# EAGLE design motor (EAGLE 7.2.0)
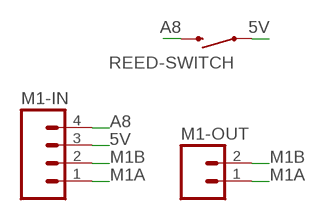
[diagram p0: schematic, sheet 1]

## Parts
M1-IN  M04JST  [1X04-1.5MM_JST]
M1-OUT  M02JST-PTH-2  [JST-2-PTH]
REED-SWITCH  SWITCH-MOMENTARY-2PTH_REED2  [REED_SWITCH_PLASTIC]

## Nets
5V: M1-IN.3 REED-SWITCH.P$1
A8: M1-IN.4 REED-SWITCH.P$2
M1A: M1-IN.1 M1-OUT.1
M1B: M1-IN.2 M1-OUT.2

## Library data of the parts
M1-IN = SparkFun-Connectors:M04: Header 4 Standard 4-pin 0.1" header. Use with straight break away headers (SKU : PRT-00116), right angle break away headers (PRT-00553), swiss pins (PRT-00743), machine pins (PRT-00117), and female headers (PRT-00115). Molex polarized connector foot print use with SKU : PRT-08231 with associated crimp pins and housings. 1MM SMD Version SKU: PRT-10208
M1-OUT = SparkFun-Connectors:M02: Standard 2-pin 0.1" header. Use with - straight break away headers ( PRT-00116) - right angle break away headers (PRT-00553) - swiss pins (PRT-00743) - machine pins (PRT-00117) - female headers (PRT-00115) Molex polarized connector foot print use with: PRT-08233 with associated crimp pins and housings. 2.54_SCREWTERM for use with PRT-10571. 3.5mm Screw Terminal footprints for PRT-08084 5mm Screw Terminal footprints for use with PRT-08432; PROD_ID: CONN-09863; SKU: PRT-09914
REED-SWITCH = SparkFun-Electromechanical:SWITCH-MOMENTARY-2: Various NO switches- pushbuttons, reed, etc

## Net classes
0 default: width 0.203 mm

## Board
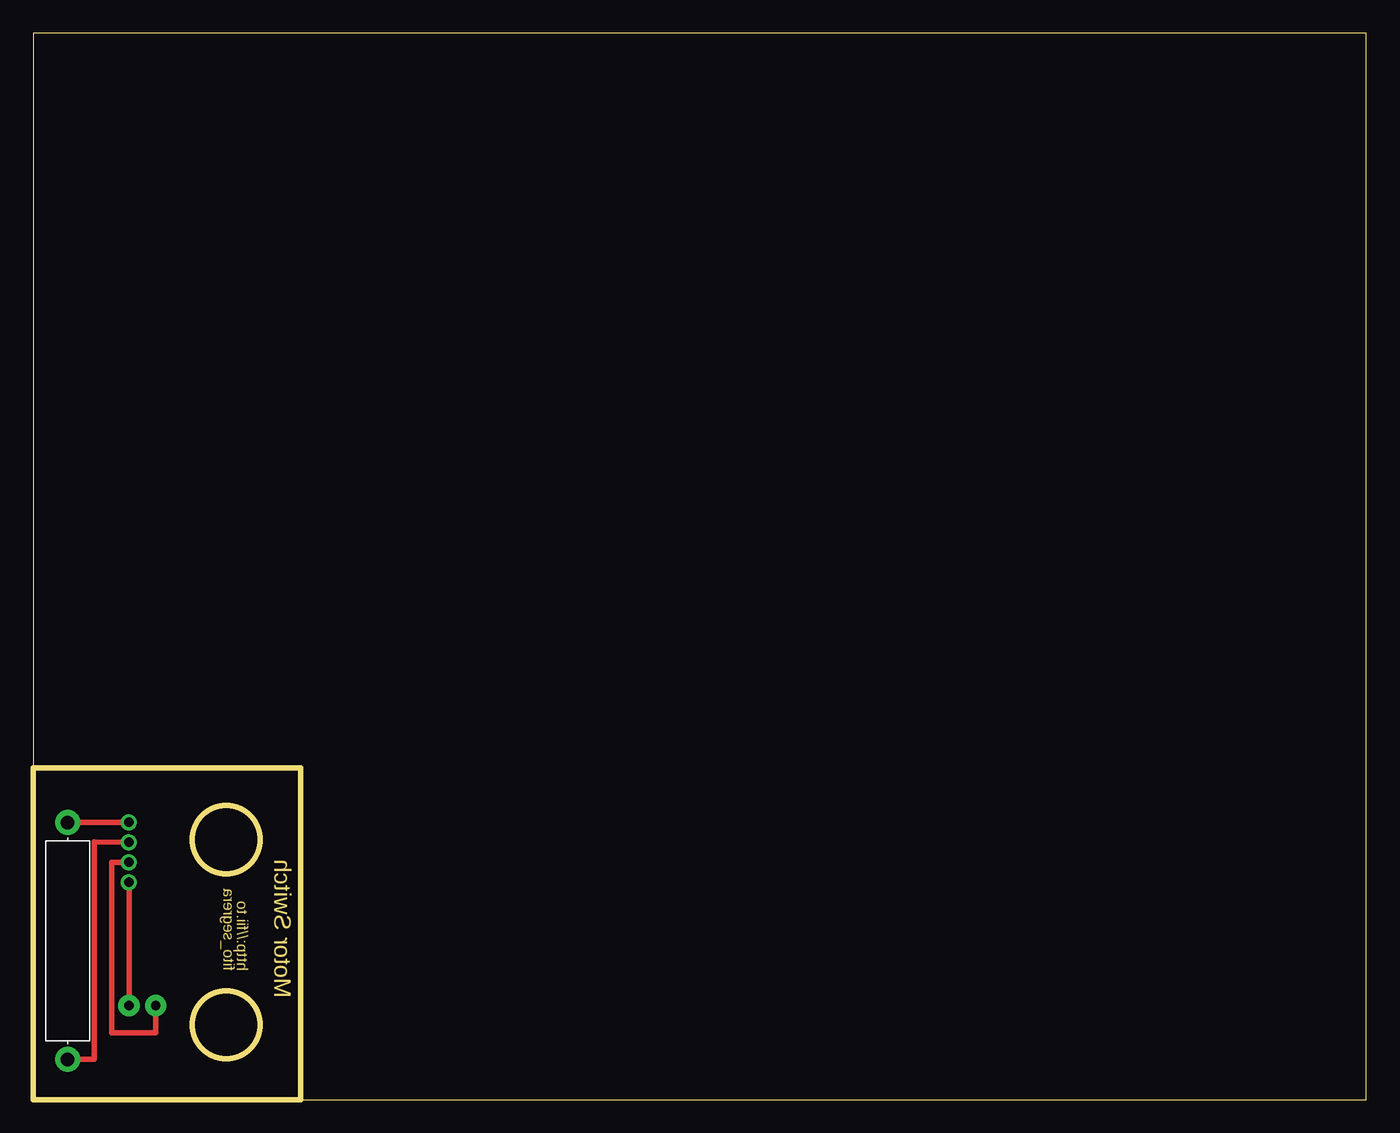
[diagram p1: board, top side]
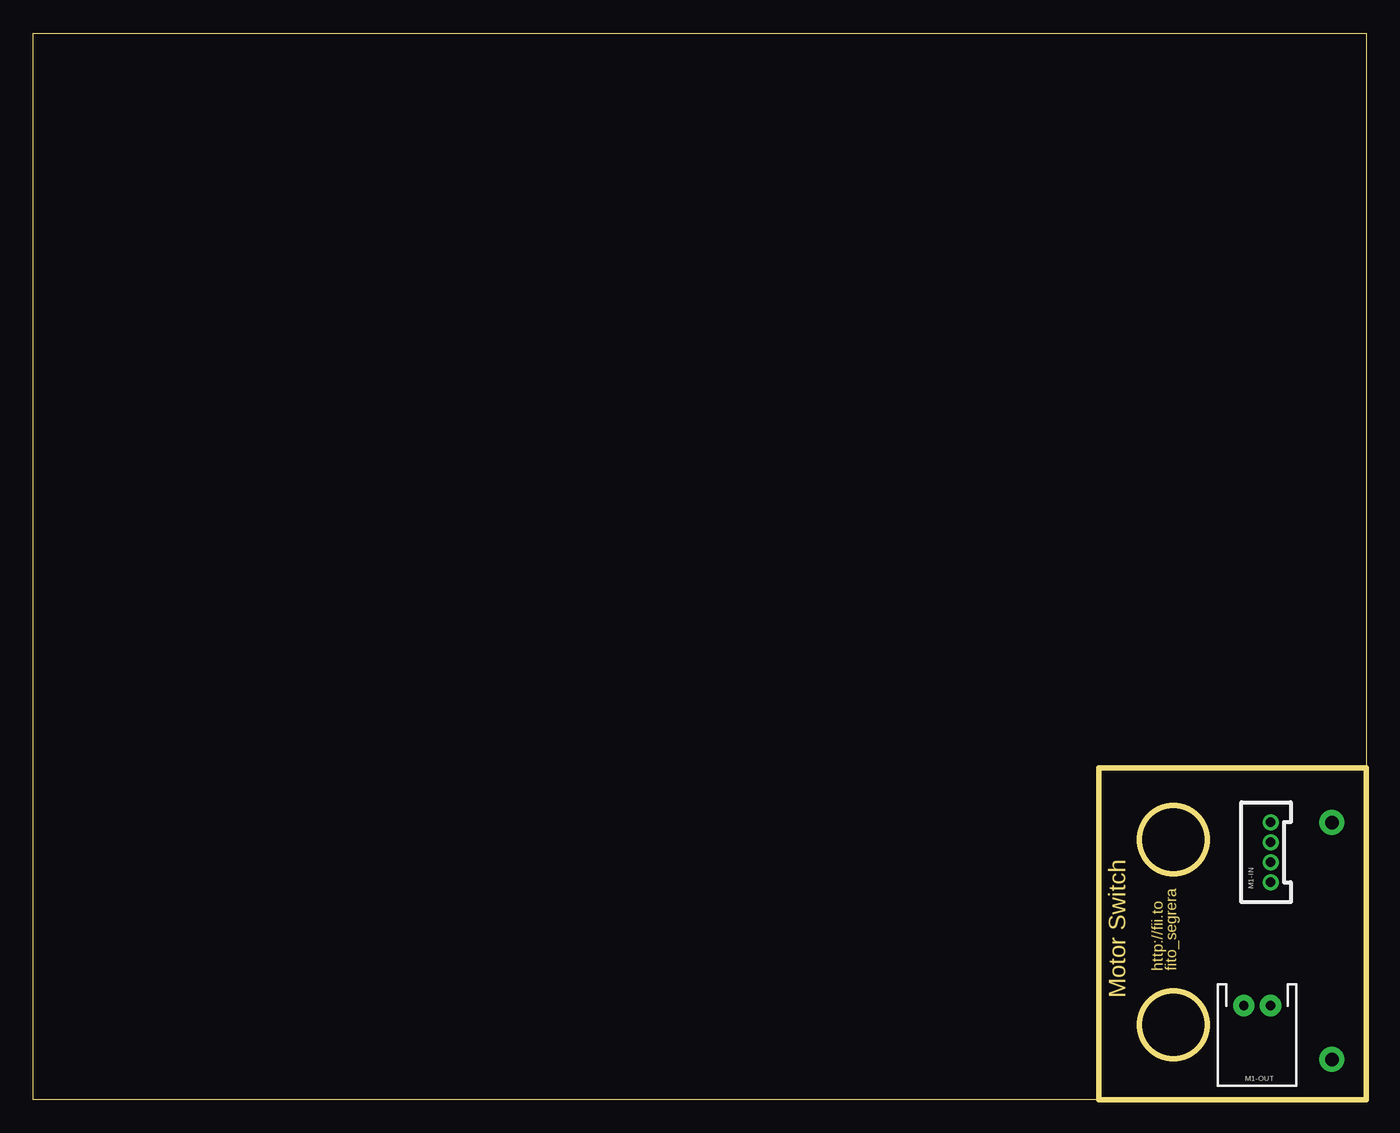
[diagram p2: board, bottom side, seen from below]

Size 100 x 80 mm. Coordinates in mm from the lower left corner, seen from the top.
Outline: 20.07,0 100,0 100,80 0,80 0,24.89
Outline: 20.07,0 0,0 0,24.89
Outline: 20.07,0 20.07,24.89 0,24.89
Outline: circle at 14.46,19.5 radius 2.54
Outline: circle at 14.46,5.6 radius 2.54
Copper layers (1*16): Top 0.035mm / dielectric 1.5mm / Bottom 0.035mm
Design rules "default": minimum track width 10mil, minimum drill 24mil, track to track 8mil, track to pad 8mil, pad to pad 8mil, via to via 8mil, smd to smd 8mil, copper to edge 40mil, drill to drill 8mil, minimum pad ring 10mil, minimum via ring 8mil, stop-mask expansion 4mil, vias tented up to drill 0mil, thermal gap 10mil

### Footprints (pad centres in the part's own frame; a part is rotated, then mirrored left to right if it is on the bottom)
1X04-1.5MM_JST = drill 0.7: 1 0,0; 2 1.5,0; 3 3,0; 4 4.5,0
JST-2-PTH = drill 0.7 pad 1.6: 1 -1,0; 2 1,0
REED_SWITCH_PLASTIC = drill 1.016 pad 1.88: P$1 -8.89,0; P$2 8.89,0

### Placement (x,y rotation side)
M1-IN  7.16,16.31 90 bottom
M1-OUT  8.18,7.04 180 bottom
REED-SWITCH  2.57,11.89 90 top

### Tracks (layer width: path | path; a pad name or v marks a point on that pad's centre or on a via)
5V
  Top 0.406: M1-IN.3 4.56,19.33 4.56,3.02 REED-SWITCH.P$1
A8
  Top 0.406: REED-SWITCH.P$2 7.11,20.78 M1-IN.4
M1A
  Top 0.406: M1-IN.1 7.18,16.31 M1-OUT.1
M1B
  Top 0.406: M1-IN.2 5.87,17.81 5.87,5 9.18,5 M1-OUT.2

### Text on the board
Dimension: fito_segrera | http://fii.to | Motor Switch